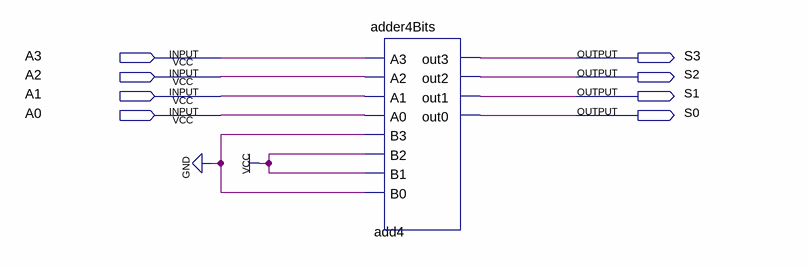
[diagram p0: schematic sheet]
// Quartus schematic subtrator.bdf as structural Verilog: 1 symbols, 8 pins
module subtrator (
  input  A3,
  input  A2,
  input  A1,
  input  A0,
  output S3,
  output S2,
  output S1,
  output S0
);

  adder4Bits add4 (
    .A3(A3), .A2(A2), .A1(A1), .A0(A0), .B3(1'b0), .B2(1'b1), .B1(1'b1), .B0(1'b0), .out3(S3), .out2(S2),
    .out1(S1), .out0(S0));
endmodule
